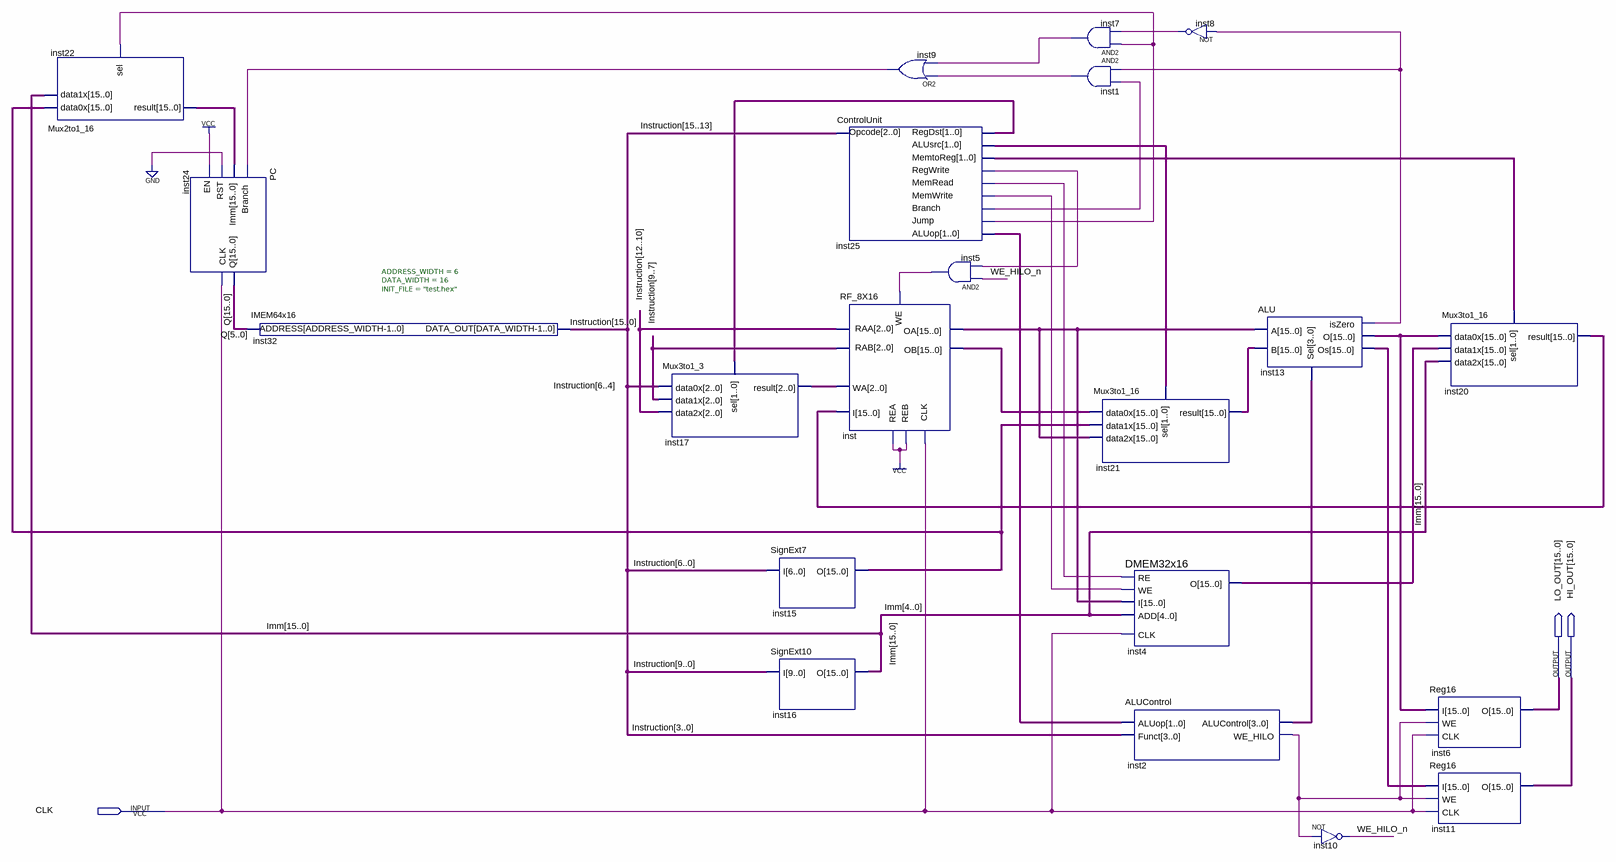
[diagram p0: schematic sheet]
// Quartus schematic CPUTopDesign.bdf as structural Verilog: 21 symbols, 3 pins
module CPUTopDesign (
  input  CLK,
  output [15:0] LO_OUT,
  output [15:0] HI_OUT
);

  wire inst1_out, inst2_we_hilo, inst5_out, inst7_out, inst8_out, inst9_out, inst13_iszero, inst25_branch,
       inst25_jump, inst25_memread, inst25_memwrite, inst25_regwrite, WE_HILO_n;
  wire [1:0] inst25_aluop, inst25_alusrc, inst25_memtoreg, inst25_regdst;
  wire [2:0] inst17_result;
  wire [3:0] inst2_alucontrol;
  wire [15:0] Imm, inst4_o, inst13_o, inst13_os, inst15_o, inst20_result, inst21_result, inst22_result,
       inst_oa, inst_ob, Instruction, Q;

  Mux2to1_16 inst22 (.data0x(inst15_o), .data1x(Imm), .sel(inst25_jump), .result(inst22_result));
  PC inst24 (.CLK(CLK), .RST(1'b0), .EN(1'b1), .Branch(inst9_out), .Imm(inst22_result), .Q(Q));
  IMEM64x16 #(.ADDRESS_WIDTH(6), .DATA_WIDTH(16), .INIT_FILE("test.hex")) inst32 (
    .ADDRESS(Q[5:0]), .DATA_OUT(Instruction));
  Mux3to1_3 inst17 (
    .data0x(Instruction[6:4]), .data1x(Instruction[9:7]), .data2x(Instruction[12:10]), .sel(inst25_regdst),
    .result(inst17_result));
  SignExt7 inst15 (.I(Instruction[6:0]), .O(inst15_o));
  SignExt10 inst16 (.I(Instruction[9:0]), .O(Imm));
  ControlUnit inst25 (
    .Opcode(Instruction[15:13]), .RegDst(inst25_regdst), .ALUsrc(inst25_alusrc), .MemtoReg(inst25_memtoreg),
    .RegWrite(inst25_regwrite), .MemRead(inst25_memread), .MemWrite(inst25_memwrite), .Branch(inst25_branch),
    .Jump(inst25_jump), .ALUop(inst25_aluop));
  RF_8X16 inst (
    .I(inst20_result), .WA(inst17_result), .WE(inst5_out), .RAA(Instruction[12:10]), .REA(1'b1),
    .RAB(Instruction[9:7]), .REB(1'b1), .CLK(CLK), .OB(inst_ob), .OA(inst_oa));
  or inst9 (inst9_out, inst1_out, inst7_out);
  and inst5 (inst5_out, WE_HILO_n, inst25_regwrite);
  and inst7 (inst7_out, inst25_jump, inst8_out);
  and inst1 (inst1_out, inst13_iszero, inst25_branch);
  Mux3to1_16 inst21 (
    .data0x(inst_ob), .data1x(inst15_o), .data2x(inst_oa), .sel(inst25_alusrc), .result(inst21_result));
  DMEM32x16 inst4 (.ADD(Imm), .I(inst_oa), .WE(inst25_memwrite), .RE(inst25_memread), .CLK(CLK), .O(inst4_o));
  ALUControl inst2 (
    .ALUop(inst25_aluop), .Funct(Instruction[3:0]), .ALUControl(inst2_alucontrol), .WE_HILO(inst2_we_hilo));
  not inst8 (inst8_out, inst13_iszero);
  ALU inst13 (
    .Sel(inst2_alucontrol), .A(inst_oa), .B(inst21_result), .O(inst13_o), .Os(inst13_os),
    .isZero(inst13_iszero));
  not inst10 (WE_HILO_n, inst2_we_hilo);
  Reg16 inst6 (.WE(inst2_we_hilo), .CLK(CLK), .I(inst13_o), .O(LO_OUT));
  Reg16 inst11 (.WE(inst2_we_hilo), .CLK(CLK), .I(inst13_os), .O(HI_OUT));
  Mux3to1_16 inst20 (.data0x(inst13_o), .data1x(inst4_o), .data2x(Imm), .sel(inst25_memtoreg), .result(inst20_result));
endmodule
